# EAGLE design r162_scart (EAGLE 5.06)
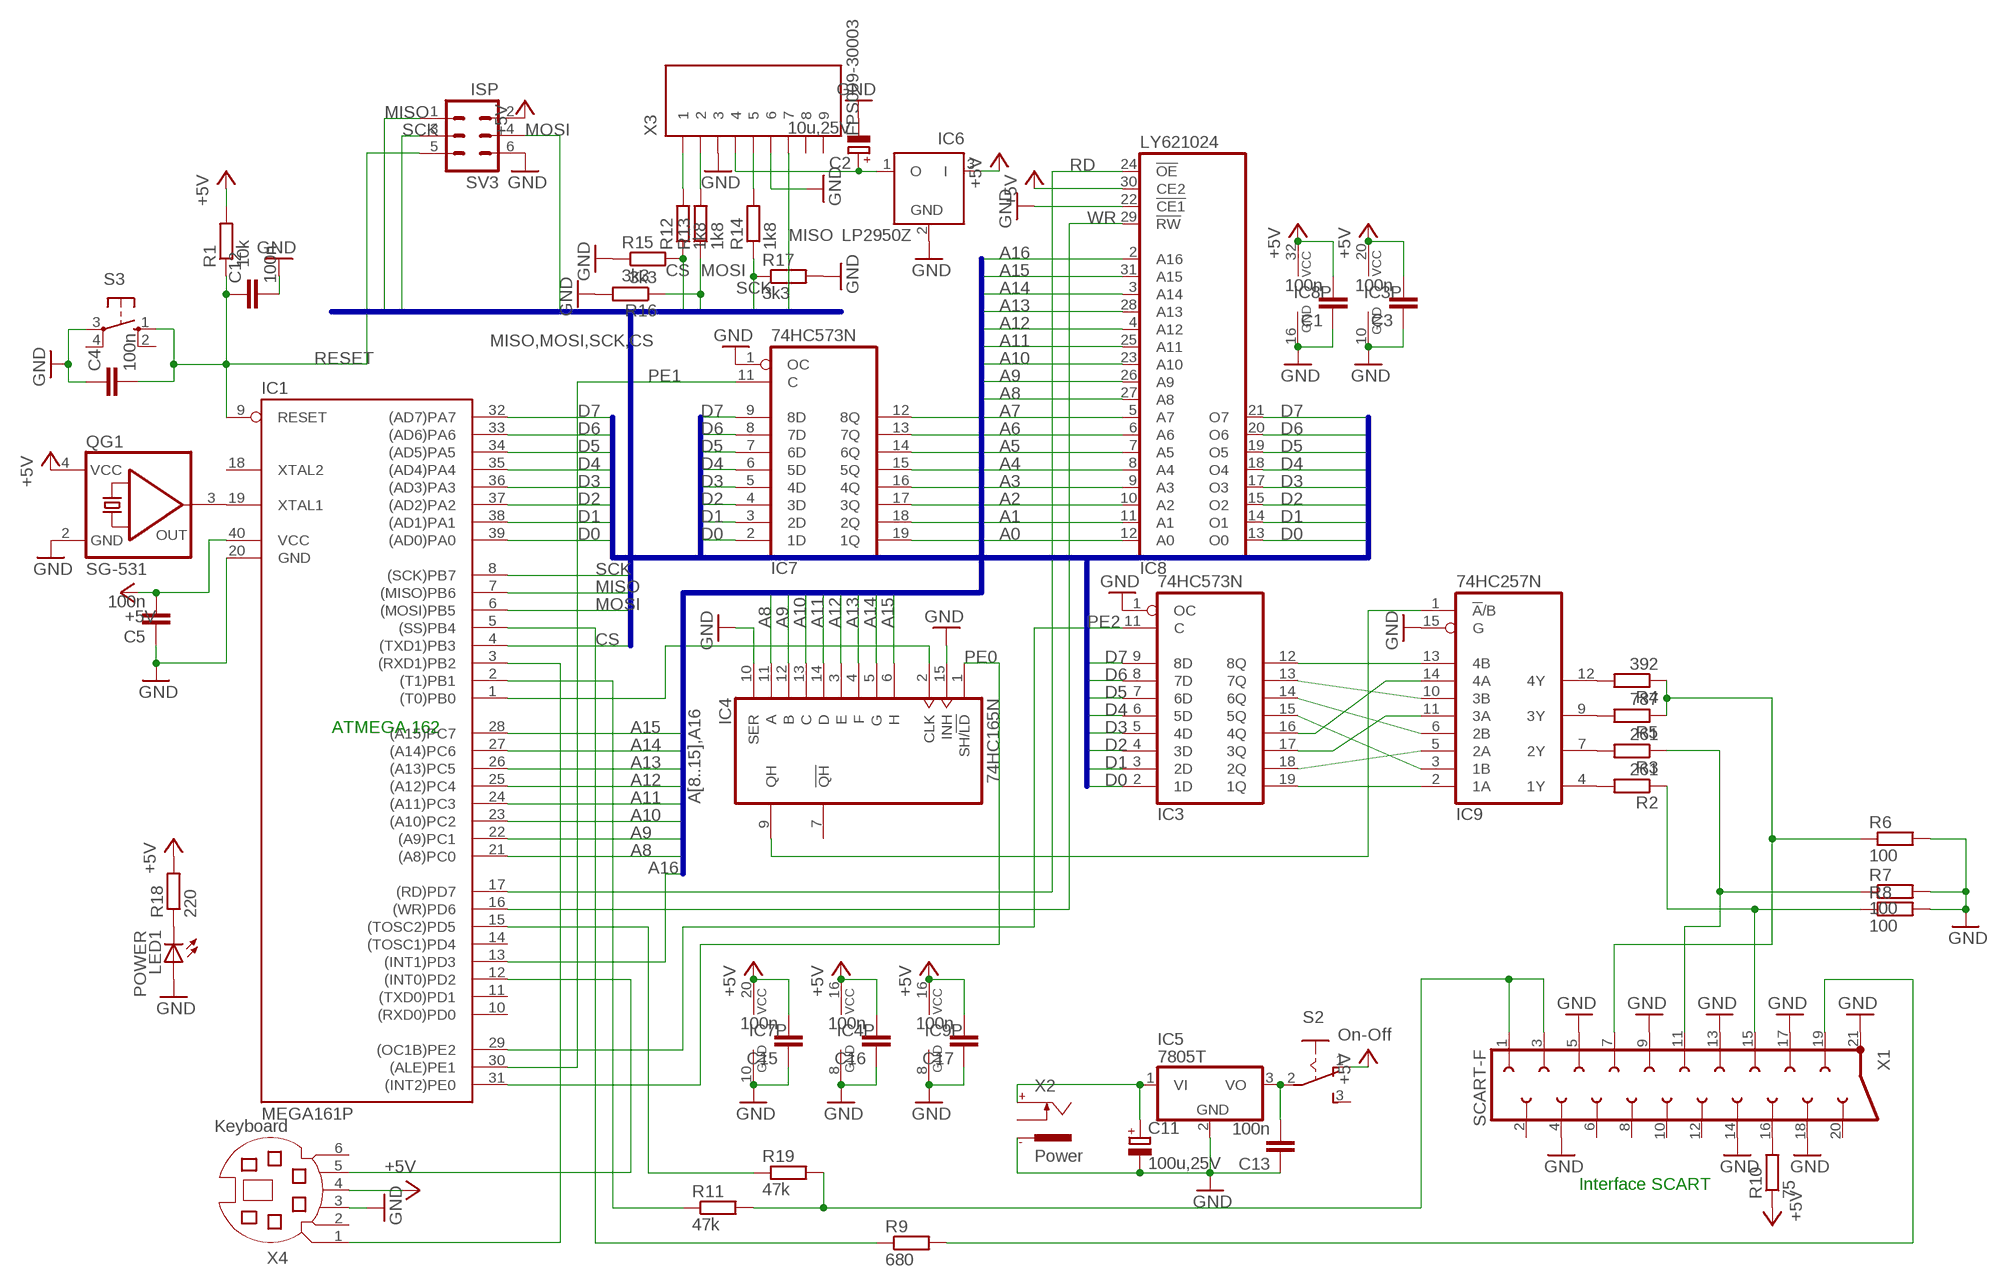
[diagram p0: schematic, sheet 1]

## Parts
C1  100n  C5/3  [C5B3]
C2  10u,25V  CPOL-EUB45181B  [B45181B]
C3  100n  C5/3  [C5B3]
C4  100n  C5/3  [C5B3]
C5  100n  C5/3  [C5B3]
C11  100u,25V  CPOL-EUB45181B  [B45181B]
C12  100n  C5/3  [C5B3]
C13  100n  C5/3  [C5B3]
C15  100n  C5/3  [C5B3]
C16  100n  C5/3  [C5B3]
C17  100n  C5/3  [C5B3]
IC1  MEGA161P  [DIL40]
IC3  74HC573N  [DIL20]
IC4  74HC165N  [DIL16]
IC5  7805T  [TO220H]
IC6  LP2950Z  [TO92]
IC7  74HC573N  [DIL20]
IC8  LY621024  TC551001CP  [DIL32]
IC9  74HC257N  [DIL16]
LED1  POWER  LED5MM  [LED5MM]
QG1  SG-531  SG531  [DIL08-4]
R1  10k  R-EU_0207/12  [0207/12]
R2  261  R-EU_0207/12  [0207/12]
R3  261  R-EU_0207/12  [0207/12]
R4  392  R-EU_0207/12  [0207/12]
R5  787  R-EU_0207/12  [0207/12]
R6  100  R-EU_0207/12  [0207/12]
R7  100  R-EU_0207/12  [0207/12]
R8  100  R-EU_0207/12  [0207/12]
R9  680  R-EU_0207/12  [0207/12]
R10  75  R-EU_0207/12  [0207/12]
R11  47k  R-EU_0207/12  [0207/12]
R12  1k8  R-EU_0207/12  [0207/12]
R13  1k8  R-EU_0207/12  [0207/12]
R14  1k8  R-EU_0207/12  [0207/12]
R15  3k3  R-EU_0207/12  [0207/12]
R16  3k3  R-EU_0207/12  [0207/12]
R17  3k3  R-EU_0207/12  [0207/12]
R18  220  R-EU_0207/12  [0207/12]
R19  47k  R-EU_0207/12  [0207/12]
S2  On-Off  M251  [M251]
S3  10-XX  [B3F-10XX]
SV3  ISP  MA03-2  [MA03-2]
X1  SCART-F  [SCART-F]
X2  Power  737992-55  [737992-5]
X3  FPS009-30003  [FPS009-3003]
X4  Keyboard  MD06SS  [MDIN06SS]

## Nets
+5V [power]: C1.2 C3.2 C5.2 C15.2 C16.2 C17.2 IC1.40(VCC) IC3.20(VCC) IC4.16(VCC) IC6.3(I) IC7.20(VCC) IC8.30(CE2) IC8.32(VCC) IC9.16(VCC) QG1.4(VCC) R1.2 R10.1 R18.2 S2.1(O) SV3.2 X4.4
A0: IC7.19(1Q) IC8.12(A0)
A1: IC7.18(2Q) IC8.11(A1)
A2: IC7.17(3Q) IC8.10(A2)
A3: IC7.16(4Q) IC8.9(A3)
A4: IC7.15(5Q) IC8.8(A4)
A5: IC7.14(6Q) IC8.7(A5)
A6: IC7.13(7Q) IC8.6(A6)
A7: IC7.12(8Q) IC8.5(A7)
A8: IC1.21((A8)PC0) IC4.11(A) IC8.27(A8)
A9: IC1.22((A9)PC1) IC4.12(B) IC8.26(A9)
A10: IC1.23((A10)PC2) IC4.13(C) IC8.23(A10)
A11: IC1.24((A11)PC3) IC4.14(D) IC8.25(A11)
A12: IC1.25((A12)PC4) IC4.3(E) IC8.4(A12)
A13: IC1.26((A13)PC5) IC4.4(F) IC8.28(A13)
A14: IC1.27((A14)PC6) IC4.5(G) IC8.3(A14)
A15: IC1.28((A15)PC7) IC4.6(H) IC8.31(A15)
A16: IC1.13((INT1)PD3) IC8.2(A16)
AUDIO: R11.2 R19.2 X1.1 X1.3
CS: IC1.4((TXD1)PB3) R12.1 R15.2
D0: IC1.39((AD0)PA0) IC3.2(1D) IC7.2(1D) IC8.13(O0)
D1: IC1.38((AD1)PA1) IC3.3(2D) IC7.3(2D) IC8.14(O1)
D2: IC1.37((AD2)PA2) IC3.4(3D) IC7.4(3D) IC8.15(O2)
D3: IC1.36((AD3)PA3) IC3.5(4D) IC7.5(4D) IC8.17(O3)
D4: IC1.35((AD4)PA4) IC3.6(5D) IC7.6(5D) IC8.18(O4)
D5: IC1.34((AD5)PA5) IC3.7(6D) IC7.7(6D) IC8.19(O5)
D6: IC1.33((AD6)PA6) IC3.8(7D) IC7.8(7D) IC8.20(O6)
D7: IC1.32((AD7)PA7) IC3.9(8D) IC7.9(8D) IC8.21(O7)
GND [power]: C1.1 C2.- C3.1 C4.1 C5.1 C11.- C12.2 C13.1 C15.1 C16.1 C17.1 IC1.20(GND) IC3.1(OC) IC3.10(GND) IC4.8(GND) IC4.10(SER) IC4.15(INH) IC5.2(GND) IC6.2(GND) IC7.1(OC) IC7.10(GND) IC8.16(GND) IC8.22(!CE1) IC9.8(GND) IC9.15(G) LED1.A QG1.2(GND) R6.2 R7.2 R8.2 R15.1 R16.2 R17.2 S3.3(P) SV3.6 X1.4 X1.5 X1.9 X1.13 X1.14 X1.17 X1.18 X1.21 X2.-1 X3.3 X3.6 X4.3
KBDCLK: IC1.12((INT0)PD2) X4.5
KBDDATA: IC1.3((RXD1)PB2) X4.1
MISO: IC1.7((MISO)PB6) SV3.1 X3.7
MOSI: IC1.6((MOSI)PB5) R13.1 R16.1 SV3.4
N$1 [power]: C11.+ IC5.1(VI) X2.+
N$2: LED1.K(C) R18.1
N$3: R4.1 R5.1 R6.1 X1.7
N$4: IC1.5((SS)PB4) R9.1
N$5: R3.1 R7.1 X1.11
N$6: R2.1 R8.1 X1.15
N$7: IC4.9(QH) IC9.1(!A!/B)
N$8: R10.2 X1.16
N$9: IC1.19(XTAL1) QG1.3(OUT)
N$10: IC3.19(1Q) IC9.2(1A)
N$11: IC1.1((T0)PB0) IC4.2(CLK)
N$12: IC1.2((T1)PB1) R11.1
N$15: IC3.18(2Q) IC9.5(2A)
N$16: R12.2 X3.1
N$17: R13.2 X3.2
N$18: R14.2 X3.5
N$19: C2.+ IC6.1(O) X3.4
N$20: IC3.17(3Q) IC9.11(3A)
N$21: IC3.16(4Q) IC9.14(4A)
N$22: IC3.15(5Q) IC9.3(1B)
N$23: IC3.14(6Q) IC9.6(2B)
N$24: IC3.13(7Q) IC9.10(3B)
N$25: IC3.12(8Q) IC9.13(4B)
N$26: IC9.4(1Y) R2.2
N$27: IC9.7(2Y) R3.2
N$29: IC9.9(3Y) R5.2
N$30: IC9.12(4Y) R4.2
N$55 [power]: C13.2 IC5.3(VO) S2.2(P)
PE0: IC1.31((INT2)PE0) IC4.1(SH/!LD)
PE1: IC1.30((ALE)PE1) IC7.11(C)
PE2: IC1.29((OC1B)PE2) IC3.11(C)
RD: IC1.17((RD)PD7) IC8.24(!OE)
RESET: C4.2 C12.1 IC1.9(RESET) R1.1 S3.1(S) SV3.5
S0: IC1.15((TOSC2)PD5) R19.1
SCK: IC1.8((SCK)PB7) R14.1 R17.1 SV3.3
SYNC: R9.2 X1.19
WR: IC1.16((WR)PD6) IC8.29(!RW)
Unconnected: IC1.10((RXD0)PD0) IC1.11((TXD0)PD1) IC1.14((TOSC1)PD4) IC1.18(XTAL2) IC4.7(!QH) IC8.1(NC) S2.3(S) S3.2(S1) S3.4(P1) X1.2 X1.6 X1.8 X1.10 X1.12 X1.20 X2.-2 X2.K X3.8 X3.9 X4.2 X4.6

## Buses
A[8..15],A16
D[0..7]
MISO,MOSI,SCK,CS

## Notes on the sheet
- ATMEGA 162
- Interface SCART

## Library data of the parts
C1 C3-C5 C12 C13 C15-C17 = capacitor-wima:C: CAPACITOR naming: grid - package width
C2 C11 = rcl:CPOL-EU: POLARIZED CAPACITOR, European symbol
IC1 = atmel:MEGA161*P: MICROCONTROLLER 16 Kbytes FLASH 512 bytes EEPROM 1 Kbytes SRAM dual UART hardware multiplier Source: avr.lbr
IC3 IC7 = 74xx-eu:74*573: 8-bit D latch BUS DRIVER
IC4 = 74xx-eu:74*165: 8-bit parallel load SHIFT REGISTER
IC5 = linear:78*: Positive VOLTAGE REGULATOR Source: http://cache.national.com/ds/LM/LM78L05.pdf http://www.fairchildsemi.com/ds/LM/LM7805.pdf
IC6 = linear:LP2950: 100 mA, Low Power Low Dropout Voltage Regulator Source: http://www.onsemi.com/pub/Collateral/LP2950-D.PDF
IC8 = memory:TC551001CP: MEMORY
IC9 = 74xx-eu:74*257: Quadruple 2-to 1 line data SELECTOR/MULTIPLEXER
LED1 = led:LED: LED OSRAM: - CHIPLED LG R971, LG N971, LY N971, LG Q971, LY Q971, LO R971, LY R971 LH N974, LH R974 LS Q976, LO Q976, LY Q976 LO Q996 - Hyper CHIPLED LW Q18S LB Q993, LB Q99A, LB R99A - SideLED LS A670, LO A670, LY A670, LG A670, LP A670 LB A673, LV A673, LT A673, LW A673 LH A674 LY A675 LS A676, LA A676, LO A676, LY A676, LW A676 LS A679, LY A679, LG A679 - Hyper Micro SIDELED® LS Y876, LA Y876, LO Y876, LY Y876 LT Y87S - SmartLED LW L88C, LW L88S LB L89C, LB L89S, LG L890 LS L89K, LO L89K, LY L89K LS L896, LA L896, LO L896, LY L896 - TOPLED LS T670, LO T670, LY T670, LG T670, LP T670 LSG T670, LSP T670, LSY T670, LOP T670, LYG T670 LG T671, LOG T671, LSG T671 LB T673, LV T673, LT T673, LW T673 LH T674 LS T676, LA T676, LO T676, LY T676, LB T676, LH T676, LSB T676, LW T676 LB T67C, LV T67C, LT T67C, LS T67K, LO T67K, LY T67K, LW E67C LS E67B, LA E67B, LO E67B, LY E67B, LB E67C, LV E67C, LT E67C LW T67C LS T679, LY T679, LG T679 LS T770, LO T770, LY T770, LG T770, LP T770 LB T773, LV T773, LT T773, LW T773 LH T774 LS E675, LA E675, LY E675, LS T675 LS T776, LA T776, LO T776, LY T776, LB T776 LHGB T686 LT T68C, LB T68C - Hyper Mini TOPLED® LB M676 - Mini TOPLED Santana® LG M470 LS M47K, LO M47K, LY M47K Source: http://www.osram.convergy.de LUXEON: - LUMILED® LXK2-PW12-R00, LXK2-PW12-S00, LXK2-PW14-U00, LXK2-PW14-V00 LXK2-PM12-R00, LXK2-PM12-S00, LXK2-PM14-U00 LXK2-PE12-Q00, LXK2-PE12-R00, LXK2-PE12-S00, LXK2-PE14-T00, LXK2-PE14-U00 LXK2-PB12-K00, LXK2-PB12-L00, LXK2-PB12-M00, LXK2-PB14-N00, LXK2-PB14-P00, LXK2-PB14-Q00 LXK2-PR12-L00, LXK2-PR12-M00, LXK2-PR14-Q00, LXK2-PR14-R00 LXK2-PD12-Q00, LXK2-PD12-R00, LXK2-PD12-S00 LXK2-PH12-R00, LXK2-PH12-S00 LXK2-PL12-P00, LXK2-PL12-Q00, LXK2-PL12-R00 Source: www.luxeon.com KINGBRIGHT: KA-3528ASYC Source: www.kingbright.com
QG1 = crystal:SG531: CRYSTAL RESONATOR
R1-R19 = rcl:R-EU_: RESISTOR, European symbol
S2 = switch:M251: SLIDING SWITCH Mors, distributor Buerklin, 11G702
S3 = switch-omron:10-XX: OMRON SWITCH
SV3 = con-lstb:MA03-2: PIN HEADER
X1 = con-hirschmann:SCART-F: TV SCART CONNECTOR
X2 = con-conrad:737992-55: FEMALE PRINT CONNECTOR DIN 45323 (34V/3A), ROKA, distributor Conrad
X3 = con-yamaichi:FPS009-30*: SD Card and MMC Reader (Manual Insertion) Source: http://www.yamaichi.de/pdf/c_fps009_3000.pdf
X4 = con-yamaichi:MD06SS: YAMAICHI CONNECTOR

## Net classes
0 default: width 0.254 mm, drill 0.305 mm, clearance 0.203 mm
1 power: width 0.711 mm, drill 0.305 mm, clearance 0.203 mm

## Board
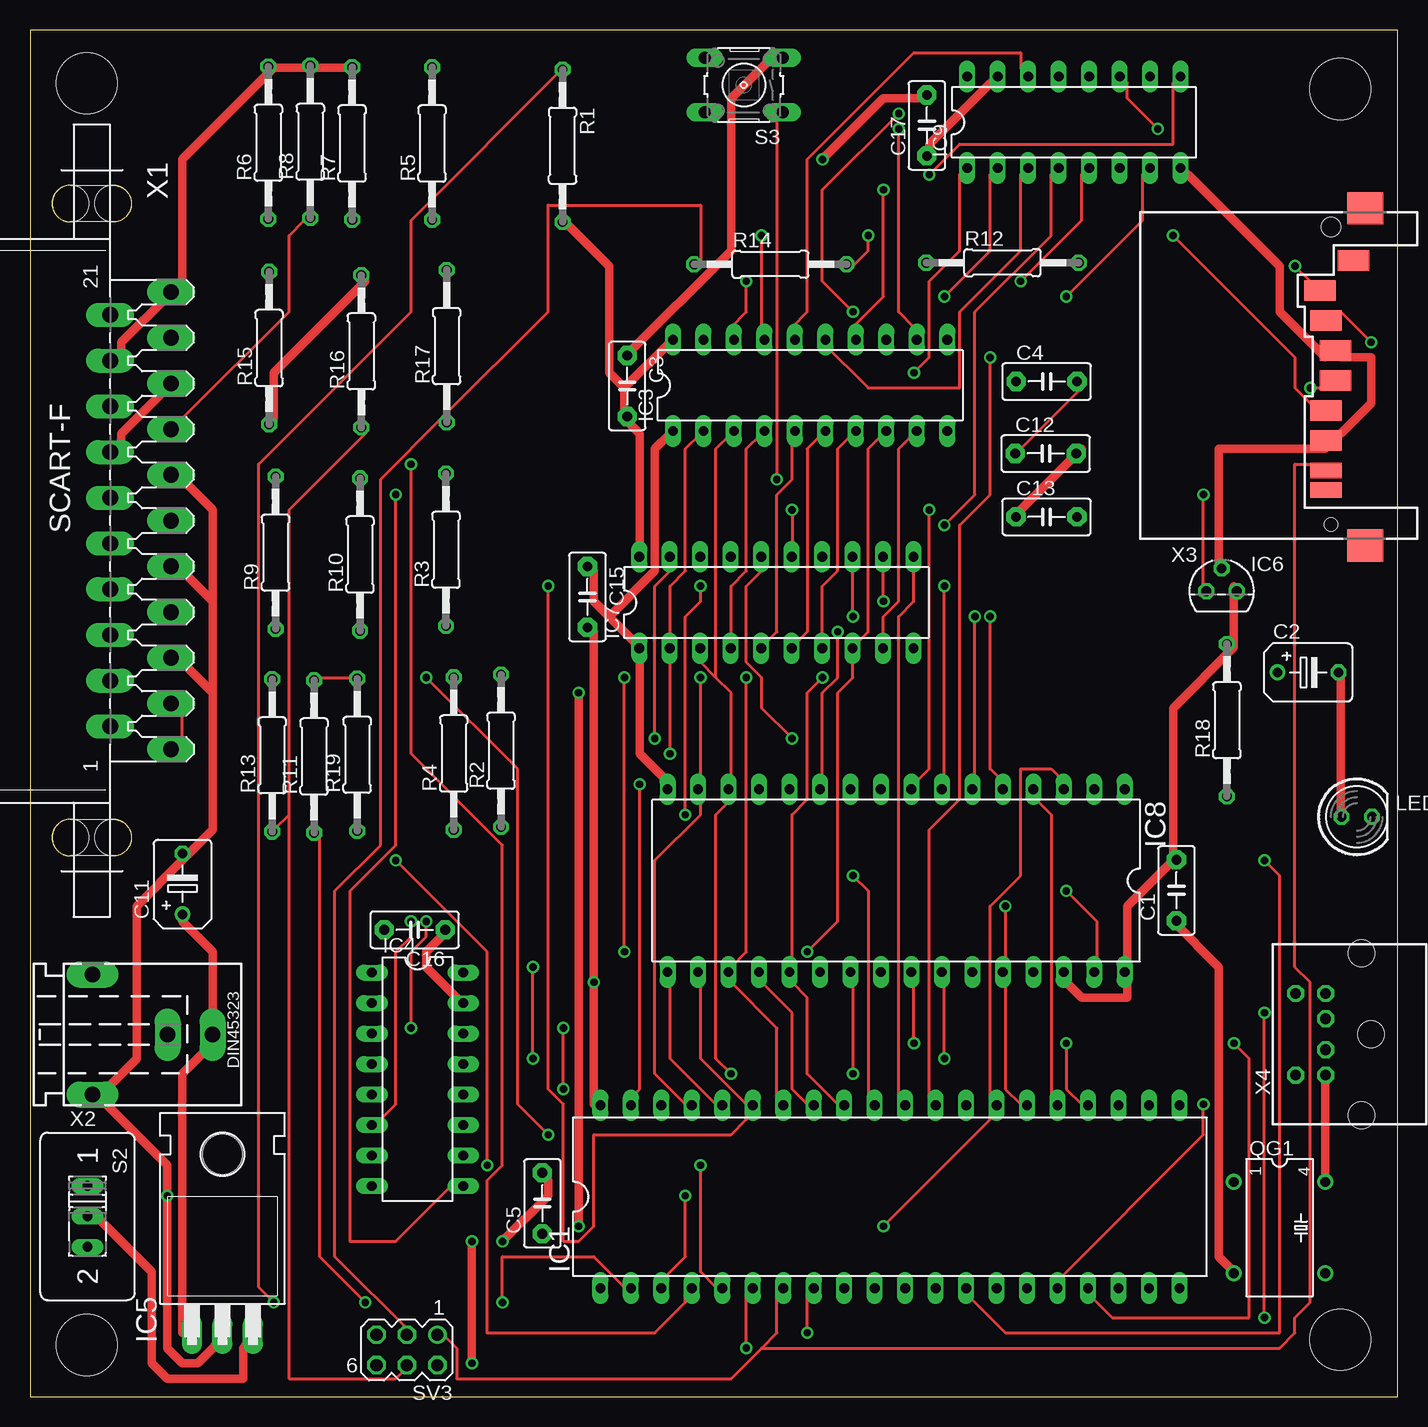
[diagram p1: board, top side]
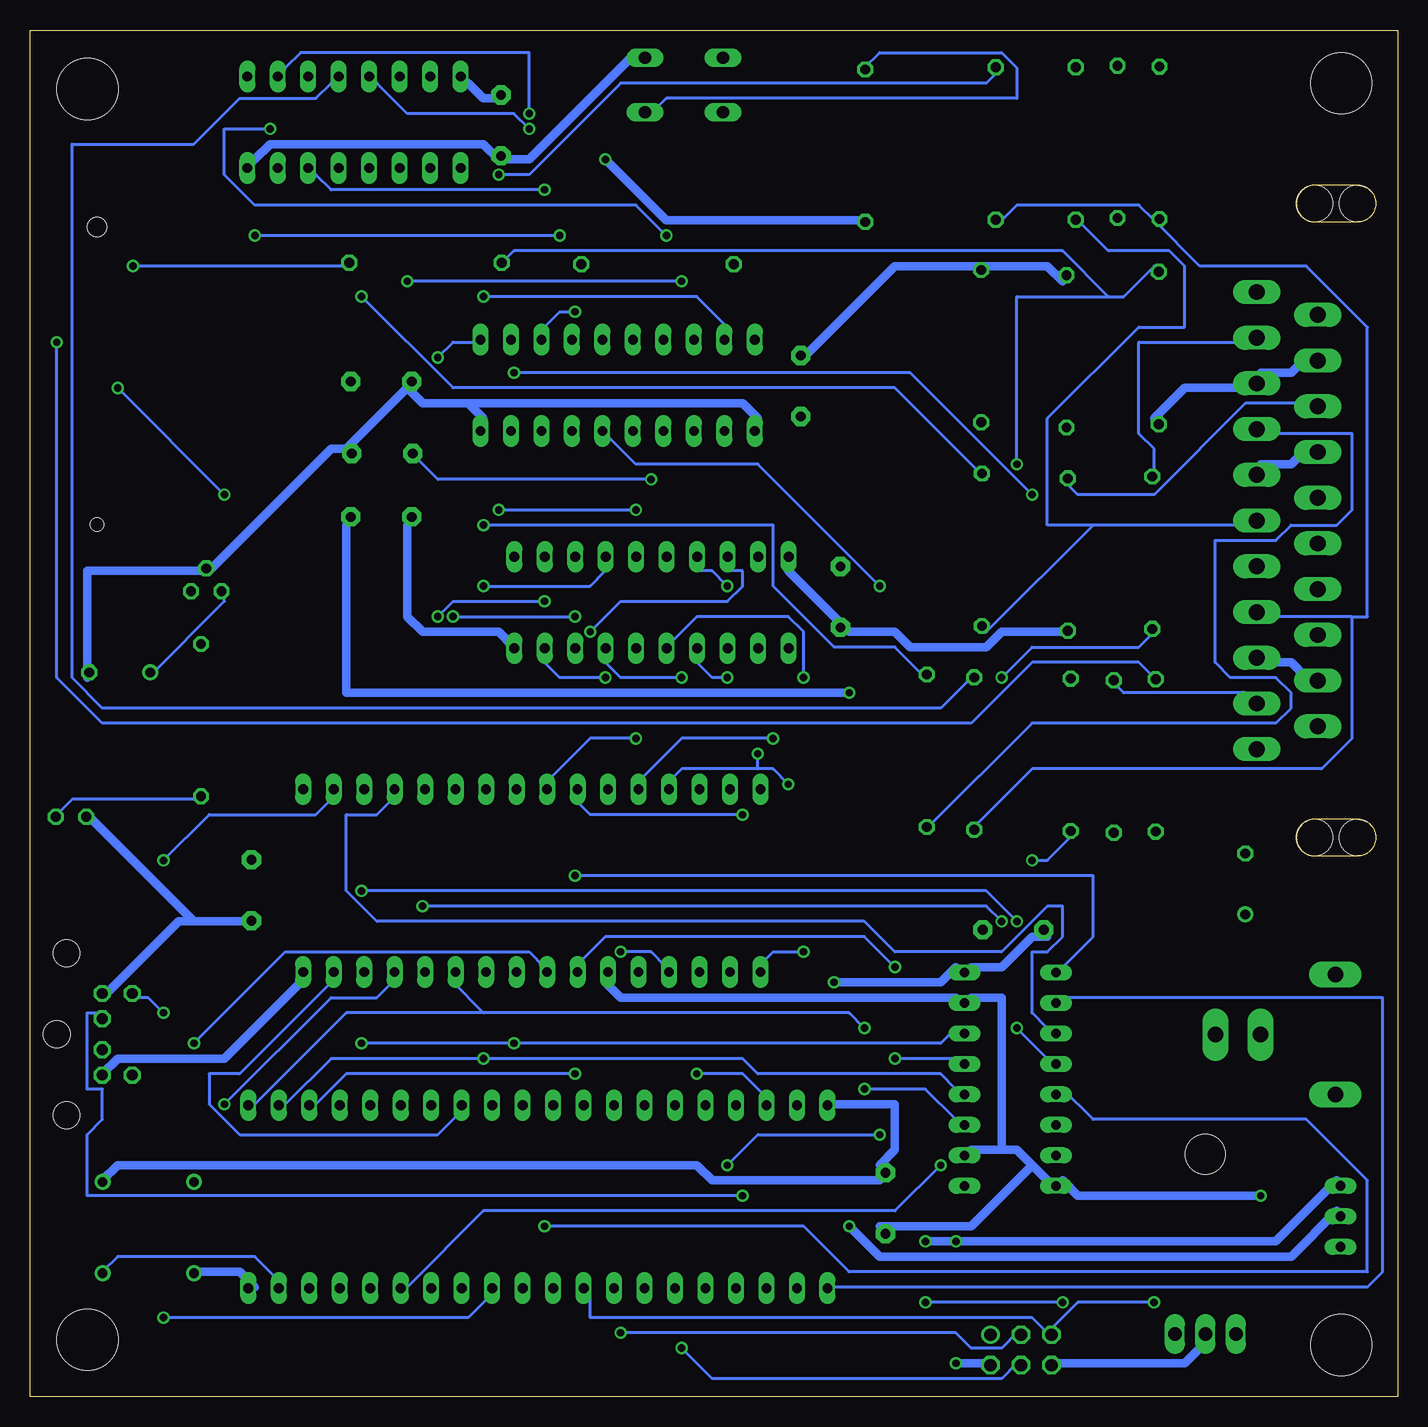
[diagram p2: board, bottom side, seen from below]

Size 113.99 x 113.9 mm. Coordinates in mm from the lower left corner, seen from the top.
Outline: 0,0 113.99,0 113.99,113.9 0,113.9 0,0
Copper layers (1*16): Top 0.035mm / dielectric 1.5mm / Bottom 0.035mm
Design rules "default": minimum track width 10mil, minimum drill 24mil, track to track 8mil, track to pad 8mil, pad to pad 8mil, via to via 8mil, smd to smd 8mil, copper to edge 40mil, drill to drill 8mil, minimum pad ring 10mil, minimum via ring 8mil, stop-mask expansion 4mil, vias tented up to drill 0mil, thermal gap 10mil
Holes 5.08 mm at 4.72,109.47 109.19,108.99 109.19,4.75 4.72,4.32

### Footprints (pad centres in the part's own frame; a part is rotated, then mirrored left to right if it is on the bottom)
C5B3 = drill 0.813 pad 1.6 octagon: 1 -2.54,0; 2 2.54,0
B45181B = drill 0.813 round: + -2.54,0 | drill 0.813 octagon: - 2.54,0
DIL40 = drill 0.813 long: 1 -24.13,-7.62; 2 -21.59,-7.62; 3 -19.05,-7.62; 4 -16.51,-7.62; 5 -13.97,-7.62; 6 -11.43,-7.62; 7 -8.89,-7.62; 8 -6.35,-7.62; 9 -3.81,-7.62; 10 -1.27,-7.62; 11 1.27,-7.62; 12 3.81,-7.62; 13 6.35,-7.62; 14 8.89,-7.62; 15 11.43,-7.62; 16 13.97,-7.62; 17 16.51,-7.62; 18 19.05,-7.62; 19 21.59,-7.62; 20 24.13,-7.62; 21 24.13,7.62; 22 21.59,7.62; 23 19.05,7.62; 24 16.51,7.62; 25 13.97,7.62; 26 11.43,7.62; 27 8.89,7.62; 28 6.35,7.62; 29 3.81,7.62; 30 1.27,7.62; 31 -1.27,7.62; 32 -3.81,7.62; 33 -6.35,7.62; 34 -8.89,7.62; 35 -11.43,7.62; 36 -13.97,7.62; 37 -16.51,7.62; 38 -19.05,7.62; 39 -21.59,7.62; 40 -24.13,7.62
DIL20 = drill 0.813 long: 1 -11.43,-3.81; 2 -8.89,-3.81; 3 -6.35,-3.81; 4 -3.81,-3.81; 5 -1.27,-3.81; 6 1.27,-3.81; 7 3.81,-3.81; 8 6.35,-3.81; 9 8.89,-3.81; 10 11.43,-3.81; 11 11.43,3.81; 12 8.89,3.81; 13 6.35,3.81; 14 3.81,3.81; 15 1.27,3.81; 16 -1.27,3.81; 17 -3.81,3.81; 18 -6.35,3.81; 19 -8.89,3.81; 20 -11.43,3.81
DIL16 = drill 0.813 long: 1 -8.89,-3.81; 2 -6.35,-3.81; 3 -3.81,-3.81; 4 -1.27,-3.81; 5 1.27,-3.81; 6 3.81,-3.81; 7 6.35,-3.81; 8 8.89,-3.81; 9 8.89,3.81; 10 6.35,3.81; 11 3.81,3.81; 12 1.27,3.81; 13 -1.27,3.81; 14 -3.81,3.81; 15 -6.35,3.81; 16 -8.89,3.81
TO220H = drill 1.118 long: 1 -2.54,-10.16; 2 0,-10.16; 3 2.54,-10.16 | hole 3.302: 0,4.826
TO92 = drill 0.813 octagon: 1 -1.27,0; 2 0,1.905; 3 1.27,0
DIL32 = drill 0.813 long: 1 -19.05,-7.62; 2 -16.51,-7.62; 3 -13.97,-7.62; 4 -11.43,-7.62; 5 -8.89,-7.62; 6 -6.35,-7.62; 7 -3.81,-7.62; 8 -1.27,-7.62; 9 1.27,-7.62; 10 3.81,-7.62; 11 6.35,-7.62; 12 8.89,-7.62; 13 11.43,-7.62; 14 13.97,-7.62; 15 16.51,-7.62; 16 19.05,-7.62; 17 19.05,7.62; 18 16.51,7.62; 19 13.97,7.62; 20 11.43,7.62; 21 8.89,7.62; 22 6.35,7.62; 23 3.81,7.62; 24 1.27,7.62; 25 -1.27,7.62; 26 -3.81,7.62; 27 -6.35,7.62; 28 -8.89,7.62; 29 -11.43,7.62; 30 -13.97,7.62; 31 -16.51,7.62; 32 -19.05,7.62
LED5MM = drill 0.813 octagon: A -1.27,0; K 1.27,0
DIL08-4 = drill 0.813 round: 1 -3.81,-3.81; 2 3.81,-3.81; 3 3.81,3.81; 4 -3.81,3.81
0207/12 = drill 0.813 octagon: 1 -6.35,0; 2 6.35,0
M251 = drill 0.813 long: 1 -2.54,0; 2 0,0; 3 2.54,0
B3F-10XX = drill 1.016 long: 1 -3.251,2.261; 2 3.251,2.261; 3 -3.251,-2.261; 4 3.251,-2.261
MA03-2 = drill 1.016 round: 1 -2.54,-1.27 | drill 1.016 octagon: 2 -2.54,1.27; 3 0,-1.27; 4 0,1.27; 5 2.54,-1.27; 6 2.54,1.27
SCART-F = drill 1.321 long: 1 19.05,5.08; 2 17.145,0; 3 15.24,5.08; 4 13.335,0; 5 11.43,5.08; 6 9.525,0; 7 7.62,5.08; 8 5.715,0; 9 3.81,5.08; 10 1.905,0; 11 0,5.08; 12 -1.905,0; 13 -3.81,5.08; 14 -5.715,0; 15 -7.62,5.08; 16 -9.525,0; 17 -11.43,5.08; 18 -13.335,0; 19 -15.24,5.08; 20 -17.145,0; 21 -19.05,5.08 | hole 3.023: 26.416,0.254; 26.416,-3.302; -26.416,0.254; -26.416,-3.302
737992-5 = drill 1.3 pad 2.184 long: + 0,10; -1 5,0; -2 -5,0; K 0,6.25
FPS009-3003 = smd 2.65 x 1.7: 1 -0.915,-5.3; 2 -0.415,-7.8; 3 0.385,-10.3; 4 0.385,-12.8; 5 -0.415,-15.3; 6 -0.415,-17.8; 9 1.885,-2.8 | smd 2.65 x 1.3: 7 -0.415,-20.3; 8 -0.415,-21.925 | smd 3 x 2.7: M1 2.85,1.55; M2 2.85,-26.55 | hole 1.6: 0,0 | hole 1.1: 0,-24.8
MDIN06SS = drill 0.9 octagon: 1 1.3,8.5; 2 -1.3,8.5; 3 3.4,8.5; 4 -3.4,8.5; 5 3.4,11; 6 -3.4,11 | hole 2.2: -6.75,5.5; 0,4.7; 6.75,5.5

### Placement (x,y rotation side)
C1  95.54,42.21 90 top
C2  106.5,60.37 0 top
C3  49.76,84.24 270 top
C4  84.72,84.61 0 top
C5  42.7,16.13 90 top
C11  12.71,42.74 90 top
C12  84.64,78.61 0 top
C13  84.71,73.33 0 top
C15  46.45,66.66 270 top
C16  32.06,38.92 180 top
C17  74.74,105.95 90 top
IC1  71.66,16.68 0 top
IC3  65.01,84.29 0 top
IC4  32.3,26.47 270 top
IC5  16.04,15.4 0 top
IC6  99.3,67.13 0 top
IC7  62.2,66.19 0 top
IC8  72.17,43.02 180 top
IC9  86.99,106.21 0 top
LED1  110.57,48.33 0 top
QG1  104.13,14.1 270 top
R1  44.38,104.26 270 top
R2  39.25,53.84 90 top
R3  34.67,70.59 90 top
R4  35.31,53.61 90 top
R5  33.51,104.44 90 top
R6  19.86,104.51 90 top
R7  26.84,104.45 90 top
R8  23.36,104.58 90 top
R9  20.47,70.35 90 top
R10  27.5,70.19 90 top
R11  23.67,53.36 90 top
R12  81.04,94.51 0 top
R13  20.18,53.46 90 top
R14  61.69,94.38 0 top
R15  19.92,87.4 90 top
R16  27.61,87.12 90 top
R17  34.73,87.56 90 top
R18  99.74,56.39 90 top
R19  27.27,53.51 90 top
S2  4.79,15.04 270 top
S3  59.49,109.32 180 top
SV3  31.41,3.91 180 top
X1  6.67,73.02 270 top
X2  5.21,30.18 270 top
X3  108.41,97.5 0 top
X4  116.46,30.21 90 top

### Tracks (layer width: path | path; a pad name or v marks a point on that pad's centre or on a via)
+5V  (via drill 0.61)
  Top 0.711: QG1.4 107.95,18.03 107.95,26.92 X4.4 | 100.33,62.48 100.33,67.56 IC6.3 | IC8.30 86.36,34.54 87.63,33.27 91.44,33.27 91.44,34.54 IC8.32 91.44,35.81 91.44,40.89 95.25,44.7 | 100.33,62.48 95.25,57.4 95.25,44.7 | 100.33,62.48 R18.2 | 95.25,44.7 C1.2 | 49.53,84.07 53.34,87.88 IC3.20 | 49.53,81.53 49.53,84.07 | 49.53,84.07 48.26,85.34 48.26,94.23 44.45,98.04 R1.2 | v66.04,103.12 71.12,108.2 74.93,108.2 C17.2 | v39.37,12.95 43.18,16.76 43.18,18.03 C5.2 | v36.83,12.95 v36.83,2.79 | IC1.40 46.99,24.38 v46.99,34.54 46.99,63.75 C15.2 | 49.53,81.53 50.8,80.26 50.8,70.1 IC7.20 | 49.53,81.53 C3.2
  Bottom 0.711: X4.4 107.95,26.92 106.68,28.19 97.79,28.19 91.44,34.54 IC8.32 | IC9.16 77.47,109.47 76.2,108.2 74.93,108.2 C17.2 | v66.04,103.12 60.96,98.04 44.45,98.04 R1.2 | v39.37,12.95 v36.83,12.95 10.16,12.95 5.08,18.03 S2.1 | v36.83,2.79 34.29,2.79 SV3.2 | C16.2 29.21,38.35 30.48,38.35 33.02,35.81 35.56,35.81 IC4.16 36.83,35.81 38.1,34.54 v46.99,34.54 | 45.72,63.75 41.91,63.75 40.64,62.48 34.29,62.48 33.02,63.75 27.94,63.75 R10.1 | 45.72,63.75 50.8,68.83 IC7.20 | C15.2 45.72,63.75 | IC1.40 46.99,24.38 41.91,24.38 41.91,20.57 43.18,19.3 C5.2 43.18,18.03 57.15,18.03 58.42,19.3 106.68,19.3 107.95,18.03 QG1.4
A0  (via drill 0.61)
  Top 0.254: v52.07,54.86 52.07,67.56 53.34,68.83 IC7.19
  Bottom 0.254: v52.07,54.86 59.69,54.86 63.5,51.05 IC8.12
A1  (via drill 0.61)
  Top 0.254: v67.31,63.75 67.31,59.94 66.04,58.67 66.04,51.05 IC8.11
  Bottom 0.254: v67.31,63.75 64.77,66.29 55.88,66.29 54.61,67.56 54.61,68.83 55.88,68.83 IC7.18
A2  (via drill 0.61)
  Top 0.254: v54.61,48.51 54.61,65.02 55.88,66.29 v55.88,67.56
  Bottom 0.254: v54.61,48.51 67.31,48.51 68.58,49.78 IC8.10 | v55.88,67.56 57.15,68.83 58.42,68.83 IC7.17
A3  (via drill 0.61)
  Top 0.254: v63.5,54.86 60.96,57.4 60.96,59.94 59.69,61.21 59.69,67.56 60.96,68.83 IC7.16
  Bottom 0.254: v63.5,54.86 67.31,54.86 71.12,51.05 IC8.9
A4  (via drill 0.61)
  Top 0.254: v74.93,73.91 74.93,52.32 73.66,51.05 IC8.8 | v63.5,73.91 63.5,70.1 IC7.15
  Bottom 0.254: v74.93,73.91 v63.5,73.91
A5  (via drill 0.61)
  Top 0.254: v76.2,67.56 76.2,51.05 IC8.7
  Bottom 0.254: v76.2,67.56 67.31,67.56 66.04,68.83 IC7.14
A6  (via drill 0.61)
  Top 0.254: v78.74,65.02 78.74,51.05 IC8.6 | v68.58,65.02 68.58,68.83 IC7.13
  Bottom 0.254: v78.74,65.02 v68.58,65.02
A7  (via drill 0.61)
  Top 0.254: v80.01,65.02 80.01,52.32 81.28,51.05 IC8.5 | v71.12,66.29 71.12,68.83 IC7.12
  Bottom 0.254: v80.01,65.02 78.74,66.29 v71.12,66.29
A8  (via drill 0.61)
  Top 0.254: v44.45,25.65 v44.45,30.73
  Bottom 0.254: v44.45,25.65 39.37,25.65 36.83,23.11 IC4.11 | v44.45,30.73 45.72,32 76.2,32 | 76.2,32 78.74,34.54 IC8.27 | 76.2,32 87.63,32 95.25,24.38 IC1.21
A9  (via drill 0.61)
  Top 0.254: v76.2,28.19 76.2,34.54 IC8.26
  Bottom 0.254: IC4.12 36.83,25.65 38.1,26.92 53.34,26.92 54.61,28.19 v76.2,28.19 88.9,28.19 92.71,24.38 IC1.22
A10  (via drill 0.61)
  Top 0.254: v41.91,28.19 v41.91,35.81 | v68.58,26.92 68.58,34.54 IC8.23
  Bottom 0.254: v41.91,28.19 36.83,28.19 IC4.13 | v41.91,35.81 44.45,38.35 66.04,38.35 68.58,35.81 IC8.23 | v68.58,26.92 87.63,26.92 90.17,24.38 IC1.23
A11  (via drill 0.61)
  Top 0.254: v73.66,29.46 73.66,34.54 IC8.25 | v86.36,29.46 86.36,25.65 87.63,24.38 IC1.24
  Bottom 0.254: IC4.14 36.83,30.73 38.1,29.46 v73.66,29.46 v86.36,29.46
A12
  Top 0.254: IC1.25 85.09,24.38 85.09,48.51 83.82,49.78 IC8.4
  Bottom 0.254: IC4.3 29.21,30.73 30.48,32 30.48,37.08 29.21,37.08 27.94,38.35 27.94,40.89 29.21,40.89 33.02,37.08 41.91,37.08 44.45,39.62 85.09,39.62 87.63,42.16 87.63,48.51 85.09,48.51 83.82,49.78 IC8.4
A13  (via drill 0.61)
  Top 0.254: v31.75,30.73 31.75,37.08 33.02,38.35 v33.02,39.62 | v81.28,40.89 81.28,35.81 IC8.28 81.28,34.54 81.28,25.65 82.55,24.38 IC1.26
  Bottom 0.254: v31.75,30.73 29.21,28.19 IC4.4 | v33.02,39.62 34.29,40.89 v81.28,40.89
A14  (via drill 0.61)
  Top 0.254: v71.12,14.22 80.01,23.11 80.01,24.38 | 80.01,24.38 80.01,40.89 82.55,43.43 82.55,52.32 85.09,52.32 86.36,51.05 IC8.3 | 80.01,24.38 IC1.27
  Bottom 0.254: v71.12,14.22 49.53,14.22 45.72,10.41 2.54,10.41 2.54,18.03 7.62,23.11 25.4,23.11 27.94,25.65 IC4.5
A15  (via drill 0.61)
  Top 0.254: v31.75,39.62 31.75,38.35 30.48,37.08 30.48,24.38 29.21,23.11 IC4.6 | v86.36,42.16 88.9,39.62 88.9,35.81 IC8.31
  Bottom 0.254: v31.75,39.62 34.29,42.16 v86.36,42.16 | IC1.28 77.47,24.38 80.01,21.84 96.52,21.84 99.06,24.38 99.06,26.92 96.52,26.92 88.9,34.54 IC8.31
A16  (via drill 0.61)
  Top 0.254: v102.87,44.7 104.14,43.43 104.14,5.33 81.28,5.33 77.47,9.14 IC1.13
  Bottom 0.254: v102.87,44.7 99.06,48.51 90.17,48.51 88.9,49.78 IC8.2
AUDIO
  Top 0.254: R11.2 24.13,59.94 26.67,59.94 R19.2 | X1.1 12.7,54.86 12.7,57.4 X1.3
  Bottom 0.254: R11.2 24.13,59.94 22.86,58.67 12.7,58.67 X1.3
CS  (via drill 0.61)
  Top 0.254: v31.75,77.72 31.75,53.59 39.37,45.97 39.37,19.3 38.1,18.03 38.1,5.33 52.07,5.33 54.61,7.87 54.61,9.14 IC1.4
  Bottom 0.254: v31.75,77.72 31.75,91.69 24.13,91.69 | 24.13,91.69 22.86,91.69 20.32,94.23 R15.2 | 24.13,91.69 27.94,95.5 73.66,95.5 74.93,94.23 R12.1
D0  (via drill 0.61)
  Top 0.254: IC3.2 55.88,80.26 54.61,78.99 54.61,68.83 53.34,67.56 53.34,62.48 IC7.2 53.34,61.21 v53.34,53.59 | v50.8,51.05 50.8,25.65 49.53,24.38 IC1.39
  Bottom 0.254: v50.8,51.05 52.07,52.32 53.34,52.32 | 53.34,52.32 59.69,52.32 60.96,51.05 IC8.13 | 53.34,52.32 v53.34,53.59
D1  (via drill 0.61)
  Top 0.254: v58.42,26.92 57.15,28.19 57.15,48.51 58.42,49.78 IC8.14 58.42,51.05 58.42,58.67 57.15,59.94 | 57.15,59.94 55.88,61.21 IC7.3 | 57.15,59.94 57.15,78.99 58.42,80.26 IC3.3
  Bottom 0.254: v58.42,26.92 54.61,26.92 52.07,24.38 IC1.38
D2  (via drill 0.61)
  Top 0.254: IC7.4 58.42,62.48 58.42,67.56 59.69,68.83 59.69,78.99 60.96,80.26 IC3.4 | IC1.37 54.61,24.38 52.07,26.92 52.07,44.7 55.88,48.51 55.88,49.78 IC8.15 55.88,51.05 v55.88,59.94
  Bottom 0.254: v55.88,59.94 57.15,59.94 58.42,61.21 IC7.4
D3  (via drill 0.61)
  Top 0.254: IC1.36 57.15,24.38 53.34,28.19 53.34,34.54 IC8.17 | IC7.5 60.96,62.48 62.23,63.75 62.23,75.18 63.5,76.45 63.5,80.26 IC3.5 | v49.53,37.08 v49.53,59.94
  Bottom 0.254: v49.53,37.08 52.07,37.08 53.34,35.81 IC8.17 | v49.53,59.94 49.53,63.75 50.8,65.02 58.42,65.02 60.96,62.48 IC7.5
D4  (via drill 0.61)
  Top 0.254: 59.69,24.38 55.88,28.19 55.88,34.54 IC8.18 | IC7.6 63.5,62.48 64.77,63.75 64.77,78.99 66.04,80.26 IC3.6 | 59.69,24.38 59.69,23.11 58.42,21.84 46.99,21.84 46.99,14.22 45.72,12.95 44.45,12.95 44.45,24.38 43.18,25.65 v43.18,67.56 | 59.69,24.38 IC1.35
  Bottom 0.254: v43.18,67.56 53.34,77.72 63.5,77.72 66.04,80.26 IC3.6
D5  (via drill 0.61)
  Top 0.254: IC1.34 62.23,24.38 62.23,30.73 58.42,34.54 IC8.19 58.42,35.81 59.69,37.08 v59.69,59.94 | IC7.7 66.04,62.48 66.04,67.56 67.31,68.83 67.31,78.99 68.58,80.26 IC3.7
  Bottom 0.254: v59.69,59.94 64.77,59.94 66.04,61.21 IC7.7
D6  (via drill 0.61)
  Top 0.254: IC1.33 64.77,24.38 63.5,25.65 63.5,32 60.96,34.54 IC8.20 | IC3.8 71.12,80.26 69.85,78.99 69.85,63.75 68.58,62.48 IC7.8 68.58,61.21 68.58,59.94 67.31,58.67 67.31,39.62 v64.77,37.08
  Bottom 0.254: v64.77,37.08 62.23,37.08 60.96,35.81 IC8.20
D7  (via drill 0.61)
  Top 0.254: IC1.32 67.31,24.38 64.77,26.92 64.77,33.27 63.5,34.54 IC8.21 63.5,35.81 63.5,48.51 64.77,49.78 64.77,58.67 v66.04,59.94 | IC7.9 71.12,62.48 71.12,65.02 72.39,66.29 72.39,78.99 73.66,80.26 IC3.9
  Bottom 0.254: v66.04,59.94 69.85,59.94 71.12,61.21 IC7.9
GND  (via drill 0.61)
  Top 0.711: IC9.15 80.01,109.47 74.93,104.39 74.93,103.12 C17.1 | IC9.8 96.52,101.85 104.14,94.23 104.14,90.42 107.95,86.61 X3.3 109.22,86.61 111.76,86.61 111.76,82.8 109.22,80.26 X3.6 107.95,78.99 99.06,78.99 99.06,68.83 IC6.2 | LED1.A 109.22,48.51 109.22,59.94 C2.- | QG1.2 100.33,10.41 99.06,11.68 99.06,35.81 95.25,39.62 C1.1 | 48.26,65.02 46.99,66.29 46.99,68.83 C15.1 | 48.26,65.02 50.8,62.48 IC7.1 50.8,61.21 50.8,53.59 53.34,51.05 IC8.16 | 48.26,65.02 52.07,68.83 52.07,78.99 53.34,80.26 IC3.1 | C13.1 82.55,73.91 87.63,78.99 C12.2 | 20.32,110.74 22.86,110.74 | 22.86,110.74 26.67,110.74 R7.2 | 22.86,110.74 R8.2 | X1.18 7.62,86.61 7.62,87.88 11.43,91.69 X1.21 12.7,92.96 12.7,103.12 20.32,110.74 | 20.32,110.74 R6.2 | R16.2 27.94,92.96 20.32,85.34 20.32,81.53 R15.1 | IC4.15 35.56,33.27 33.02,35.81 33.02,37.08 34.29,38.35 C16.1 | 12.7,44.7 15.24,47.24 15.24,58.67 | 15.24,58.67 12.7,61.21 X1.5 | 15.24,66.29 12.7,68.83 X1.9 | 15.24,58.67 15.24,66.29 | 12.7,44.7 8.89,40.89 8.89,28.19 6.35,25.65 X2.-1 6.35,24.38 11.43,19.3 v11.43,16.76 11.43,4.06 12.7,2.79 13.97,2.79 15.24,4.06 IC5.2 | 12.7,44.7 C11.- | 15.24,66.29 15.24,73.91 12.7,76.45 X1.13 | X1.17 11.43,84.07 7.62,80.26 7.62,78.99 X1.14 | S3.3 62.23,112.01 58.42,108.2 58.42,95.5 49.53,86.61 C3.1
  Bottom 0.711: 74.93,103.12 72.39,103.12 63.5,112.01 S3.3 | 74.93,103.12 76.2,104.39 93.98,104.39 95.25,103.12 IC9.8 | 74.93,103.12 C17.1 | IC1.20 95.25,9.14 96.52,10.41 100.33,10.41 QG1.2 | 100.33,39.62 95.25,39.62 C1.1 | 100.33,39.62 101.6,39.62 107.95,33.27 X4.3 | 100.33,39.62 109.22,48.51 LED1.A | IC7.10 73.66,62.48 74.93,63.75 81.28,63.75 82.55,65.02 82.55,72.64 C13.1 | 77.47,82.8 76.2,81.53 IC3.10 | 77.47,82.8 81.28,82.8 82.55,84.07 | 99.06,68.83 88.9,78.99 87.63,78.99 | 87.63,78.99 82.55,84.07 | 82.55,84.07 C4.1 | 87.63,78.99 C12.2 | 77.47,82.8 54.61,82.8 53.34,81.53 IC3.1 | 99.06,68.83 109.22,68.83 109.22,59.94 C2.- | IC6.2 99.06,68.83 | 34.29,94.23 29.21,94.23 27.94,92.96 R16.2 | 34.29,94.23 41.91,94.23 49.53,86.61 C3.1 | 34.29,94.23 R17.2 | R15.1 20.32,81.53 17.78,84.07 12.7,84.07 X1.17 11.43,85.34 8.89,85.34 7.62,86.61 X1.18 | 30.48,19.3 31.75,20.57 33.02,20.57 | 30.48,19.3 29.21,18.03 IC4.8 27.94,18.03 26.67,16.76 v11.43,16.76 | 33.02,20.57 35.56,20.57 IC4.10 | 30.48,19.3 35.56,14.22 43.18,14.22 C5.1 | IC8.22 66.04,34.54 64.77,33.27 36.83,33.27 IC4.15 35.56,33.27 33.02,33.27 33.02,20.57 | SV3.6 29.21,2.79 17.78,2.79 16.51,4.06 IC5.2 | X1.14 7.62,78.99 8.89,77.72 11.43,77.72 X1.13 | X1.4 7.62,59.94 8.89,61.21 11.43,61.21 X1.5
KBDCLK  (via drill 0.61)
  Top 0.254: v102.87,6.6 v102.87,32
  Bottom 0.254: v102.87,6.6 77.47,6.6 74.93,9.14 IC1.12 | v102.87,32 104.14,33.27 105.41,33.27 X4.5
KBDDATA  (via drill 0.61)
  Top 0.254: v54.61,16.76 54.61,11.68 52.07,9.14 IC1.3
  Bottom 0.254: v54.61,16.76 109.22,16.76 109.22,21.84 107.95,23.11 107.95,25.65 109.22,25.65 109.22,32 107.95,32 X4.1
MISO
  Top 0.254: 60.96,4.06 58.42,1.52 35.56,1.52 35.56,4.06 34.29,5.33 SV3.1 | 60.96,4.06 62.23,5.33 62.23,9.14 IC1.7 | 60.96,4.06 104.14,4.06 105.41,5.33 105.41,6.6 106.68,7.87 106.68,34.54 105.41,35.81 105.41,77.72 107.95,77.72 X3.7
MOSI  (via drill 0.61)
  Top 0.254: v59.69,4.06 59.69,9.14 IC1.6 | 21.59,48.51 20.32,47.24 R13.1 | 21.59,48.51 21.59,73.91 27.94,80.26 R16.1 | 21.59,48.51 21.59,1.52 30.48,1.52 31.75,2.79 SV3.4
  Bottom 0.254: v59.69,4.06 57.15,1.52 33.02,1.52 31.75,2.79 SV3.4
N$1
  Top 0.711: C11.+ 12.7,39.62 15.24,37.08 15.24,30.73 X2.+ 15.24,29.46 12.7,26.92 12.7,5.33 IC5.1
N$2
  Bottom 0.254: R18.1 100.33,49.78 110.49,49.78 111.76,48.51 LED1.K
N$3
  Bottom 0.254: 20.32,98.04 21.59,99.31 31.75,99.31 33.02,98.04 R5.1 | 3.81,65.02 3.81,54.86 6.35,52.32 30.48,52.32 35.56,47.24 R4.1 | 3.81,65.02 11.43,65.02 X1.7 | 20.32,98.04 16.51,94.23 7.62,94.23 2.54,89.15 2.54,65.02 3.81,65.02 | 20.32,98.04 R6.1
N$4  (via drill 0.61)
  Top 0.254: v55.88,19.3 55.88,10.41 57.15,9.14 IC1.5 | v43.18,21.84 40.64,24.38 40.64,52.32 v33.02,59.94
  Bottom 0.254: v55.88,19.3 53.34,21.84 v43.18,21.84 | v33.02,59.94 30.48,62.48 21.59,62.48 20.32,63.75 R9.1
N$5
  Bottom 0.254: 25.4,72.64 34.29,63.75 R3.1 | 25.4,72.64 12.7,72.64 X1.11 | 25.4,72.64 29.21,72.64 29.21,81.53 21.59,89.15 17.78,89.15 17.78,94.23 19.05,95.5 24.13,95.5 26.67,98.04 R7.1
N$6
  Top 0.254: R8.1 22.86,98.04 21.59,96.77 21.59,90.42 12.7,81.53 X1.15
  Bottom 0.254: R2.1 39.37,47.24 30.48,56.13 10.16,56.13 8.89,57.4 8.89,58.67 10.16,59.94 13.97,59.94 15.24,61.21 15.24,71.37 10.16,71.37 8.89,72.64 5.08,72.64 3.81,73.91 3.81,80.26 11.43,80.26 X1.15
N$7  (via drill 0.61)
  Top 0.254: v30.48,75.18 30.48,45.97 26.67,42.16 26.67,12.95 30.48,12.95 35.56,18.03 IC4.9 | v73.66,85.34 74.93,86.61 74.93,92.96 77.47,95.5 77.47,101.85 IC9.1
  Bottom 0.254: v30.48,75.18 40.64,85.34 v73.66,85.34
N$8
  Bottom 0.254: R10.2 27.94,76.45 26.67,75.18 20.32,75.18 12.7,82.8 7.62,82.8 X1.16
N$9
  Bottom 0.254: IC1.19 92.71,9.14 95.25,11.68 106.68,11.68 107.95,10.41 QG1.3
N$10  (via drill 0.61)
  Top 0.254: v76.2,91.69 80.01,95.5 80.01,101.85 IC9.2
  Bottom 0.254: v76.2,91.69 58.42,91.69 55.88,89.15 IC3.19
N$11
  Bottom 0.254: IC1.1 46.99,9.14 2.54,9.14 1.27,10.41 1.27,33.27 27.94,33.27 IC4.2
N$12  (via drill 0.61)
  Top 0.254: v39.37,7.87 39.37,11.68 46.99,11.68 49.53,9.14 IC1.2 | v27.94,7.87 24.13,11.68 24.13,47.24 R11.1
  Bottom 0.254: v27.94,7.87 v39.37,7.87
N$15  (via drill 0.61)
  Top 0.254: v59.69,92.96 59.69,90.42 58.42,89.15 IC3.18 | v82.55,92.96 87.63,98.04 87.63,101.85 IC9.5
  Bottom 0.254: v59.69,92.96 v82.55,92.96
N$16  (via drill 0.61)
  Top 0.254: v105.41,94.23 106.68,92.96 X3.1
  Bottom 0.254: v105.41,94.23 87.63,94.23 R12.2
N$17  (via drill 0.61)
  Top 0.254: v111.76,87.88 109.22,90.42 X3.2
  Bottom 0.254: v111.76,87.88 111.76,59.94 107.95,56.13 35.56,56.13 30.48,61.21 21.59,61.21 20.32,59.94 R13.2
N$18  (via drill 0.61)
  Top 0.254: v69.85,96.77 69.85,95.5 68.58,94.23 R14.2 | v95.25,96.77 105.41,86.61 105.41,84.07 107.95,81.53 X3.5
  Bottom 0.254: v69.85,96.77 v95.25,96.77
N$19  (via drill 0.61)
  Top 0.254: v106.68,84.07 107.95,84.07 X3.4 | v97.79,75.18 97.79,67.56 IC6.1
  Bottom 0.254: C2.+ 104.14,59.94 97.79,66.29 97.79,67.56 IC6.1 | v97.79,75.18 v106.68,84.07
N$20  (via drill 0.61)
  Top 0.254: v60.96,96.77 60.96,89.15 IC3.17 | v93.98,105.66 91.44,108.2 91.44,109.47 IC9.11
  Bottom 0.254: v60.96,96.77 63.5,99.31 95.25,99.31 97.79,101.85 97.79,105.66 v93.98,105.66
N$21
  Top 0.254: IC3.16 63.5,89.15 64.77,90.42 64.77,103.12 73.66,112.01 82.55,112.01 82.55,110.74 IC9.14
N$22
  Top 0.254: IC3.15 66.04,87.88 69.85,84.07 77.47,84.07 77.47,90.42 82.55,95.5 82.55,101.85 IC9.3
N$23  (via drill 0.61)
  Top 0.254: v71.12,100.58 71.12,91.69 68.58,89.15 IC3.14
  Bottom 0.254: v71.12,100.58 88.9,100.58 90.17,101.85 IC9.6
N$24  (via drill 0.61)
  Top 0.254: v68.58,90.42 66.04,92.96 66.04,100.58 v72.39,106.93
  Bottom 0.254: v68.58,90.42 69.85,90.42 71.12,89.15 IC3.13 | v72.39,106.93 72.39,112.01 91.44,112.01 92.71,110.74 IC9.10
N$25  (via drill 0.61)
  Top 0.254: v72.39,105.66 72.39,90.42 73.66,89.15 IC3.12
  Bottom 0.254: v72.39,105.66 73.66,106.93 82.55,106.93 85.09,109.47 IC9.13
N$26  (via drill 0.61)
  Top 0.254: v76.2,72.64 78.74,75.18 78.74,90.42 85.09,96.77 85.09,101.85 IC9.4
  Bottom 0.254: v76.2,72.64 52.07,72.64 52.07,67.56 46.99,62.48 41.91,62.48 39.37,59.94 R2.2
N$27  (via drill 0.61)
  Top 0.254: v86.36,91.69 92.71,98.04 92.71,101.85 IC9.7
  Bottom 0.254: v86.36,91.69 78.74,84.07 41.91,84.07 34.29,76.45 R3.2
N$29  (via drill 0.61)
  Top 0.254: v74.93,101.85 77.47,104.39 95.25,104.39 95.25,109.47 IC9.9
  Bottom 0.254: v74.93,101.85 72.39,101.85 64.77,109.47 34.29,109.47 33.02,110.74 R5.2
N$30
  Bottom 0.254: R4.2 35.56,59.94 38.1,57.4 107.95,57.4 110.49,59.94 110.49,104.39 100.33,104.39 96.52,108.2 90.17,108.2 88.9,109.47 IC9.12
N$55  (via drill 0.61)
  Top 0.711: S2.2 5.08,15.49 10.16,10.41 10.16,2.79 11.43,1.52 17.78,1.52 17.78,4.06 IC5.3 | v45.72,14.22 v45.72,58.67
  Bottom 0.711: v45.72,58.67 87.63,58.67 87.63,72.64 C13.2 | v45.72,14.22 43.18,11.68 8.89,11.68 5.08,15.49 S2.2
PE0  (via drill 0.61)
  Top 0.254: v68.58,43.43 69.85,42.16 69.85,24.38 IC1.31
  Bottom 0.254: v68.58,43.43 25.4,43.43 25.4,38.35 27.94,35.81 IC4.1
PE1
  Top 0.254: IC1.30 72.39,24.38 72.39,65.02 73.66,66.29 73.66,68.83 IC7.11
PE2  (via drill 0.61)
  Top 0.254: v80.01,86.61 80.01,75.18 77.47,72.64 77.47,49.78 74.93,47.24 74.93,24.38 IC1.29
  Bottom 0.254: v80.01,86.61 78.74,87.88 76.2,87.88 IC3.11
RD  (via drill 0.61)
  Top 0.254: v100.33,29.46 101.6,28.19 101.6,6.6 90.17,6.6 87.63,9.14 IC1.17
  Bottom 0.254: v100.33,29.46 92.71,37.08 72.39,37.08 71.12,35.81 IC8.24
RESET  (via drill 0.61)
  Top 0.254: C12.1 82.55,78.99 87.63,84.07 C4.2 | v62.23,76.45 62.23,106.93 S3.1 | v20.32,7.87 19.05,9.14 19.05,77.72 31.75,90.42 31.75,98.04 44.45,110.74 R1.1
  Bottom 0.254: 29.21,5.33 30.48,6.6 67.31,6.6 67.31,9.14 IC1.9 | R1.1 44.45,110.74 43.18,112.01 33.02,112.01 31.75,110.74 31.75,108.2 60.96,108.2 62.23,106.93 S3.1 | v62.23,76.45 80.01,76.45 82.55,78.99 C12.1 | 29.21,5.33 26.67,7.87 v20.32,7.87 | 29.21,5.33 SV3.5
S0  (via drill 0.61)
  Top 0.254: v30.48,44.7 38.1,37.08 v38.1,19.3
  Bottom 0.254: v30.48,44.7 29.21,44.7 26.67,47.24 R19.1 | v38.1,19.3 41.91,15.49 76.2,15.49 82.55,9.14 IC1.15
SCK  (via drill 0.61)
  Top 0.254: 34.29,81.53 43.18,90.42 43.18,99.31 55.88,99.31 55.88,94.23 R14.1 | v64.77,5.33 64.77,9.14 IC1.8 | 34.29,81.53 29.21,76.45 29.21,45.97 25.4,42.16 25.4,11.68 31.75,5.33 SV3.3 | 34.29,81.53 R17.1
  Bottom 0.254: v64.77,5.33 36.83,5.33 35.56,4.06 33.02,4.06 31.75,5.33 SV3.3
SYNC
  Bottom 0.254: R9.2 20.32,76.45 20.32,78.99 21.59,80.26 21.59,87.88 12.7,87.88 X1.19
WR  (via drill 0.61)
  Top 0.254: v97.79,24.38 97.79,21.84 85.09,9.14 IC1.16
  Bottom 0.254: v97.79,24.38 88.9,33.27 85.09,33.27 83.82,34.54 IC8.29